# Altium schematic sheet Decawave.schdoc
size A
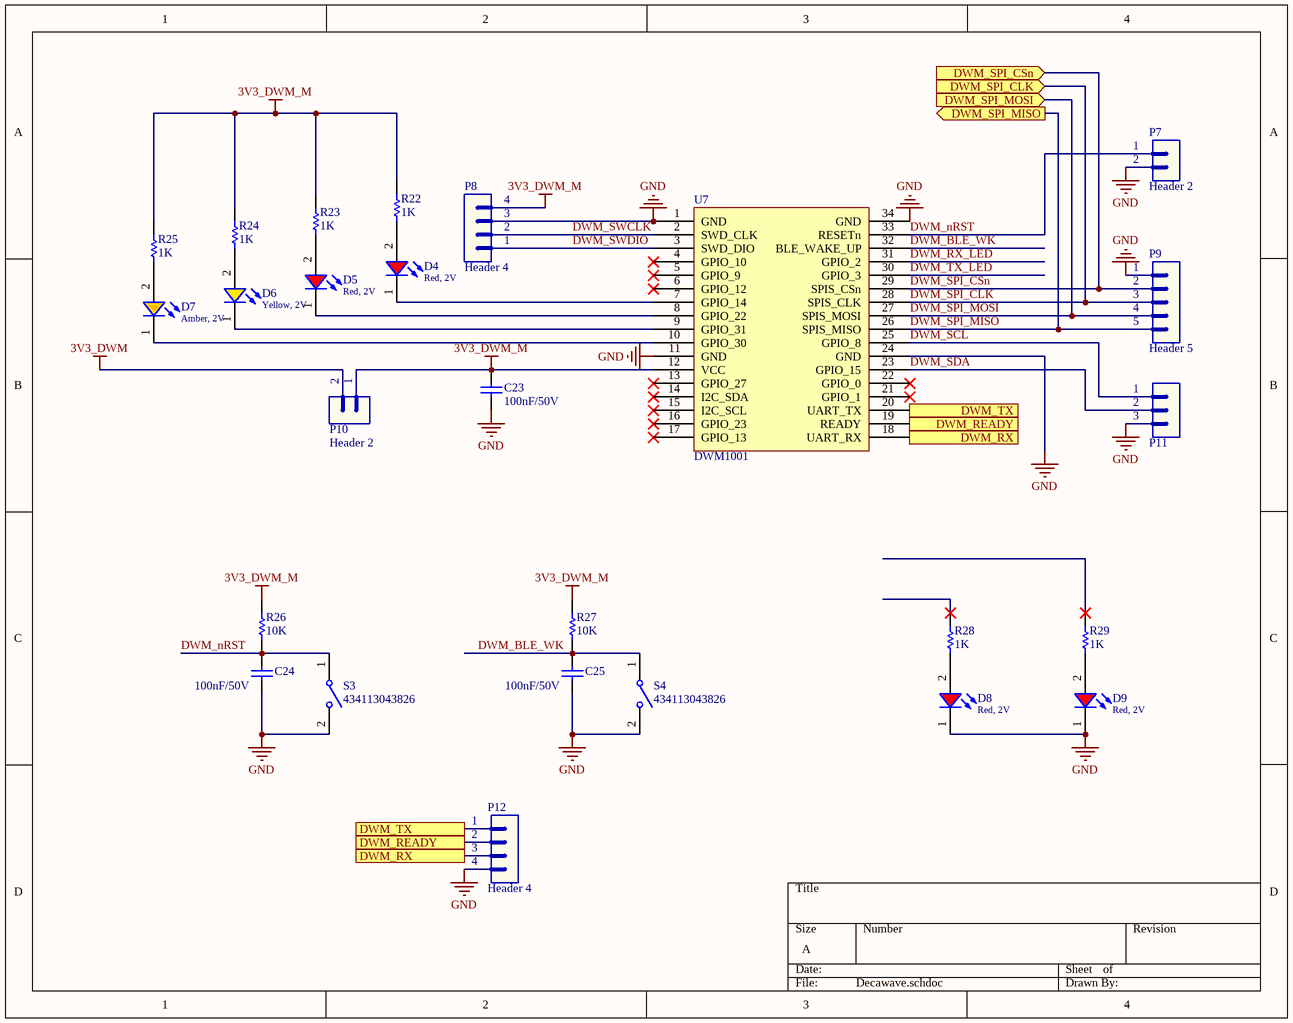
[diagram p0: Decawave.schdoc]

## Parts
C23  value 100nF/50V  [CAP-SM-0805]  (hidden comment: Cap-100nF-50V-0805)
C24  value 100nF/50V  [CAP-SM-0805]  (hidden comment: Cap-100nF-50V-0805)
C25  value 100nF/50V  [CAP-SM-0805]  (hidden comment: Cap-100nF-50V-0805)
D4  Red, 2V  [WL-SMCW_0805]
D5  Red, 2V  [WL-SMCW_0805]
D6  Yellow, 2V  [WL-SMCW_0805]
D7  Amber, 2V  [WL-SMCW_0805]
D8  Red, 2V  [WL-SMCW_0805]
D9  Red, 2V  [WL-SMCW_0805]
P7  Header 2  [JP2]
P8  Header 4  [JP4]
P9  Header 5  [JP5]
P10  Header 2  [JP2]
P11  Header 3  [JP3]  (value not drawn)
P12  Header 4  [JP4]
R22  value 1K  [RES-SM-0805]  (hidden comment: Res-1K-0805)
R23  value 1K  [RES-SM-0805]  (hidden comment: Res-1K-0805)
R24  value 1K  [RES-SM-0805]  (hidden comment: Res-1K-0805)
R25  value 1K  [RES-SM-0805]  (hidden comment: Res-1K-0805)
R26  value 10K  [RES-SM-0805]  (hidden comment: Res-10k-0805)
R27  value 10K  [RES-SM-0805]  (hidden comment: Res-10k-0805)
R28  value 1K  [RES-SM-0805]  (hidden comment: Res-1K-0805)
R29  value 1K  [RES-SM-0805]  (hidden comment: Res-1K-0805)
S3  434113043826  [434113043826]
S4  434113043826  [434113043826]
U7  DWM1001  [DWM1001]

## Ports
DWM_READY (in), DWM_READY (out), DWM_RX (in), DWM_RX (out), DWM_SPI_CLK (in), DWM_SPI_CSn (in), DWM_SPI_MISO (out), DWM_SPI_MOSI (in), DWM_TX (in), DWM_TX (out)

## Nets
3V3_DWM: P10.2
3V3_DWM_M: C23.2 P8.4 P10.1 R22.2 R23.2 R24.2 R25.2 R26.2 R27.2 U7.12(VCC)
GND: C23.1 C24.2 C25.2 D8.1(K) D9.1(K) P7.2 P8.3 P9.1 P11.3 P12.4 S3.2 S4.2 U7.1(GND) U7.11(GND) U7.24(GND) U7.34(GND)
DWM_BLE_WK: C25.1 R27.1 S4.1 U7.32(BLE_WAKE_UP)
DWM_nRST: C24.1 P7.1 R26.1 S3.1 U7.33(RESETn)
DWM_READY: P12.2 U7.19(READY) ; port DWM_READY
DWM_RX: P12.3 U7.18(UART_RX) ; port DWM_RX
DWM_RX_LED: U7.31(GPIO_2)
DWM_SCL: P11.1 U7.25(GPIO_8)
DWM_SDA: P11.2 U7.23(GPIO_15)
DWM_SPI_CLK: P9.3 U7.28(SPIS_CLK) ; port DWM_SPI_CLK
DWM_SPI_CSn: P9.2 U7.29(SPIS_CSn) ; port DWM_SPI_CSn
DWM_SPI_MISO: P9.5 U7.26(SPIS_MISO) ; port DWM_SPI_MISO
DWM_SPI_MOSI: P9.4 U7.27(SPIS_MOSI) ; port DWM_SPI_MOSI
DWM_SWCLK: P8.2 U7.2(SWD_CLK)
DWM_SWDIO: P8.1 U7.3(SWD_DIO)
DWM_TX: P12.1 U7.20(UART_TX) ; port DWM_TX
DWM_TX_LED: U7.30(GPIO_3)
NetD4_1: D4.1(K) U7.7(GPIO_14)
NetD4_2: D4.2(A) R22.1
NetD5_1: D5.1(K) U7.8(GPIO_22)
NetD5_2: D5.2(A) R23.1
NetD6_1: D6.1(K) U7.9(GPIO_31)
NetD6_2: D6.2(A) R24.1
NetD7_1: D7.1(K) U7.10(GPIO_30)
NetD7_2: D7.2(A) R25.1
NetD8_2: D8.2(A) R28.1
NetD9_2: D9.2(A) R29.1

Not connected (* = marked no-connect by the designer): R28 2*; R29 2*; U7 4(GPIO_10)* 5(GPIO_9)* 6(GPIO_12)* 13(GPIO_27)* 14(I2C_SDA)* 15(I2C_SCL)* 16(GPIO_23)* 17(GPIO_13)* 21(GPIO_1)* 22(GPIO_0)*

## Library data of the parts
C23-C25 = Cap-100nF-50V-0805: CAP CER 0.1UF 50V Y5V 0805; Manufacturer: Samsung Electro-Mechanics; Manufacturer Part Number: CL21F104ZBCNNNC; Local Supplier: thegioiic; Local Supplier Link: https://thegioiic.com/products/tu-100nf-0-1uf-50v-0805; Supplier 1: Digikey; Supplier 1 Part Number: 1276-1007-1-ND; Supplier 1 Link: https://www.digikey.com/product-detail/en/samsung-electro-mechanics/CL21F104ZBCNNNC/1276-1007-1-ND/3889093
D4 D5 D8 D9 = 150080RS75000: WL-SMCW SMT Mono-color Chip LED Waterclear, size 0805, Red, 2V, 140deg; Chip Technology: AlInGaP; Dominant Wavelength typ.: 625nm; Luminous Intensity typ.: 150mcd; Peak Wavelength typ.: 630nm; Viewing Angle: 140deg; ComponentLink1Description: Manufacturer; ComponentLink1URL: http://www.we-online.de; ComponentLink2URL: https://www.we-online.com/catalog/datasheet/150080RS75000.pdf; ComponentLink2Description: Datasheet; Forward Voltage typ.: 2V; Emitting Color: Red; Mounting Technology: SMT; Operating Temperature: -40 to +85degC; Published Date: December 2019; Part Number: 150080RS75000; Packaging: Tape and Reel; Size: 0805; Publisher: Wurth Elektronik
D6 = 150080YS75000: WL-SMCW SMT Mono-color Chip LED Waterclear, size 0805, Yellow, 2V, 140deg; Chip Technology: AlInGaP; Dominant Wavelength typ.: 590nm; Luminous Intensity typ.: 120mcd; Peak Wavelength typ.: 595nm; Viewing Angle: 140deg; ComponentLink1Description: Manufacturer; ComponentLink1URL: http://www.we-online.de; ComponentLink2URL: https://www.we-online.com/catalog/datasheet/150080YS75000.pdf; ComponentLink2Description: Datasheet; Forward Voltage typ.: 2V; Emitting Color: Yellow; Mounting Technology: SMT; Operating Temperature: -40 to +85degC; Published Date: December 2019; Part Number: 150080YS75000; Packaging: Tape and Reel; Size: 0805; Publisher: Wurth Elektronik
D7 = 150080AS75000: WL-SMCW SMT Mono-color Chip LED Waterclear, size 0805, Amber, 2V, 140deg; Chip Technology: AlInGaP; Dominant Wavelength typ.: 605nm; Luminous Intensity typ.: 130mcd; Peak Wavelength typ.: 610nm; Viewing Angle: 140deg; ComponentLink1Description: Manufacturer; ComponentLink1URL: http://www.we-online.de; ComponentLink2URL: https://www.we-online.com/catalog/datasheet/150080AS75000.pdf; ComponentLink2Description: Datasheet; Forward Voltage typ.: 2V; Emitting Color: Amber; Mounting Technology: SMT; Operating Temperature: -40 to +85degC; Published Date: December 2019; Part Number: 150080AS75000; Packaging: Tape and Reel; Size: 0805; Publisher: Wurth Elektronik
P7 P10 = Header 2: Header, 2-Pin; LatestRevisionDate: 17-Jul-2002; LatestRevisionNote: Re-released for DXP Platform.; Publisher: Altium Limited
P8 P12 = Header 4: Header, 4-Pin; LatestRevisionDate: 17-Jul-2002; LatestRevisionNote: Re-released for DXP Platform.; Publisher: Altium Limited
P9 = Header 5: Header, 5-Pin; LatestRevisionDate: 17-Jul-2002; LatestRevisionNote: Re-released for DXP Platform.; Publisher: Altium Limited
P11 = Header 3: Header, 3-Pin; LatestRevisionDate: 17-Jul-2002; LatestRevisionNote: Re-released for DXP Platform.; Publisher: Altium Limited
R22-R25 R28 R29 = Res-1K-0805: RES 1K OHM 1% 1/4W 0805; Manufacturer: Stackpole Electronics Inc; Manufacturer Part Number: RNCP0805FTD1K00; Local Supplier: thegioiic; Local Supplier Link: https://thegioiic.com/products/dien-tro-1k-ohm-0805-5; Supplier 1: Digikey; Supplier 1 Link: https://www.digikey.com/product-detail/en/stackpole-electronics-inc/RNCP0805FTD1K00/RNCP0805FTD1K00CT-ND/2240568; Supplier 1 Part Number: RNCP0805FTD1K00CT-ND
R26 R27 = Res-10k-0805: RES 10K OHM 1% 1/4W 0805; Manufacturer: Stackpole Electronics Inc; Manufacturer Part Number: RNCP0805FTD10K0; Local Supplier: thegioiic; Local Supplier Link: https://thegioiic.com/products/dien-tro-10k-ohm-0805-5; Supplier 1: Digikey; Supplier 1 Link: https://www.digikey.com/product-detail/en/stackpole-electronics-inc/RNCP0805FTD10K0/RNCP0805FTD10K0CT-ND/2240601; Supplier 1 Part Number: RNCP0805FTD10K0CT-ND
S3 S4 = 434113043826: WS-TASV J-Bend SMT Tact Switch 6x3.5mm, height 4.3mm, 260gf; Rated Voltage: 12VDC; Rated Current: 50mA; Washable: No; ComponentLink1Description: Manufacturer; ComponentLink1URL: http://www.we-online.de; ComponentLink2Description: Datasheet; ComponentLink2URL: https://katalog.we-online.com/em/datasheet/434113043826.pdf; Operating Temperature: -40 to +85degC; Part Number: 434113043826; Published Date: September 2019; Contact Material: Stainless Steel; Height: 4.3mm; Mounting Technology: SMT; Contact Plating: Silver; Operation Force: 260gf; Packaging: Tape and Reel; Terminal Material: Copper Alloy; Publisher: Wurth Elektronik; Terminal Plating: Silver